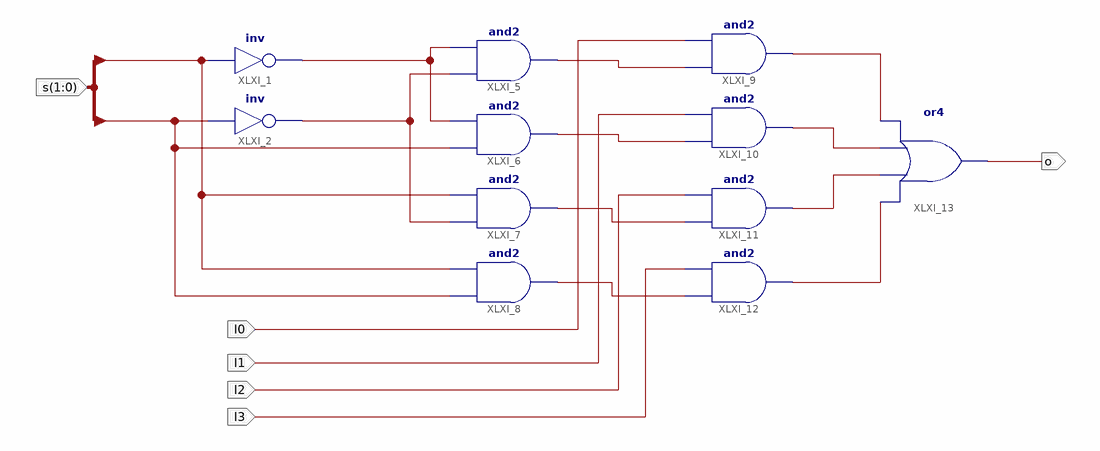
[diagram p0: schematic sheet 1]
// Xilinx ISE schematic Mux4to1.sch (artix7) as structural Verilog: 11 symbols, 6 ports
module Mux4to1 (
  input  [1:0] s,
  input  l0,
  input  l1,
  input  l2,
  input  l3,
  output o
);

  wire XLXN_8, XLXN_9, XLXN_15, XLXN_16, XLXN_17, XLXN_18, XLXN_19, XLXN_20, XLXN_21, XLXN_22;

  not XLXI_1 (XLXN_8, s[1]);
  not XLXI_2 (XLXN_9, s[0]);
  and XLXI_5 (XLXN_15, XLXN_9, XLXN_8);
  and XLXI_6 (XLXN_16, s[0], XLXN_8);
  and XLXI_7 (XLXN_17, XLXN_9, s[1]);
  and XLXI_8 (XLXN_18, s[0], s[1]);
  and XLXI_9 (XLXN_19, XLXN_15, l0);
  and XLXI_10 (XLXN_20, XLXN_16, l1);
  and XLXI_11 (XLXN_21, XLXN_17, l2);
  and XLXI_12 (XLXN_22, XLXN_18, l3);
  or XLXI_13 (o, XLXN_22, XLXN_21, XLXN_20, XLXN_19);
endmodule
